# EAGLE design Platine1 (EAGLE 7.2.0)
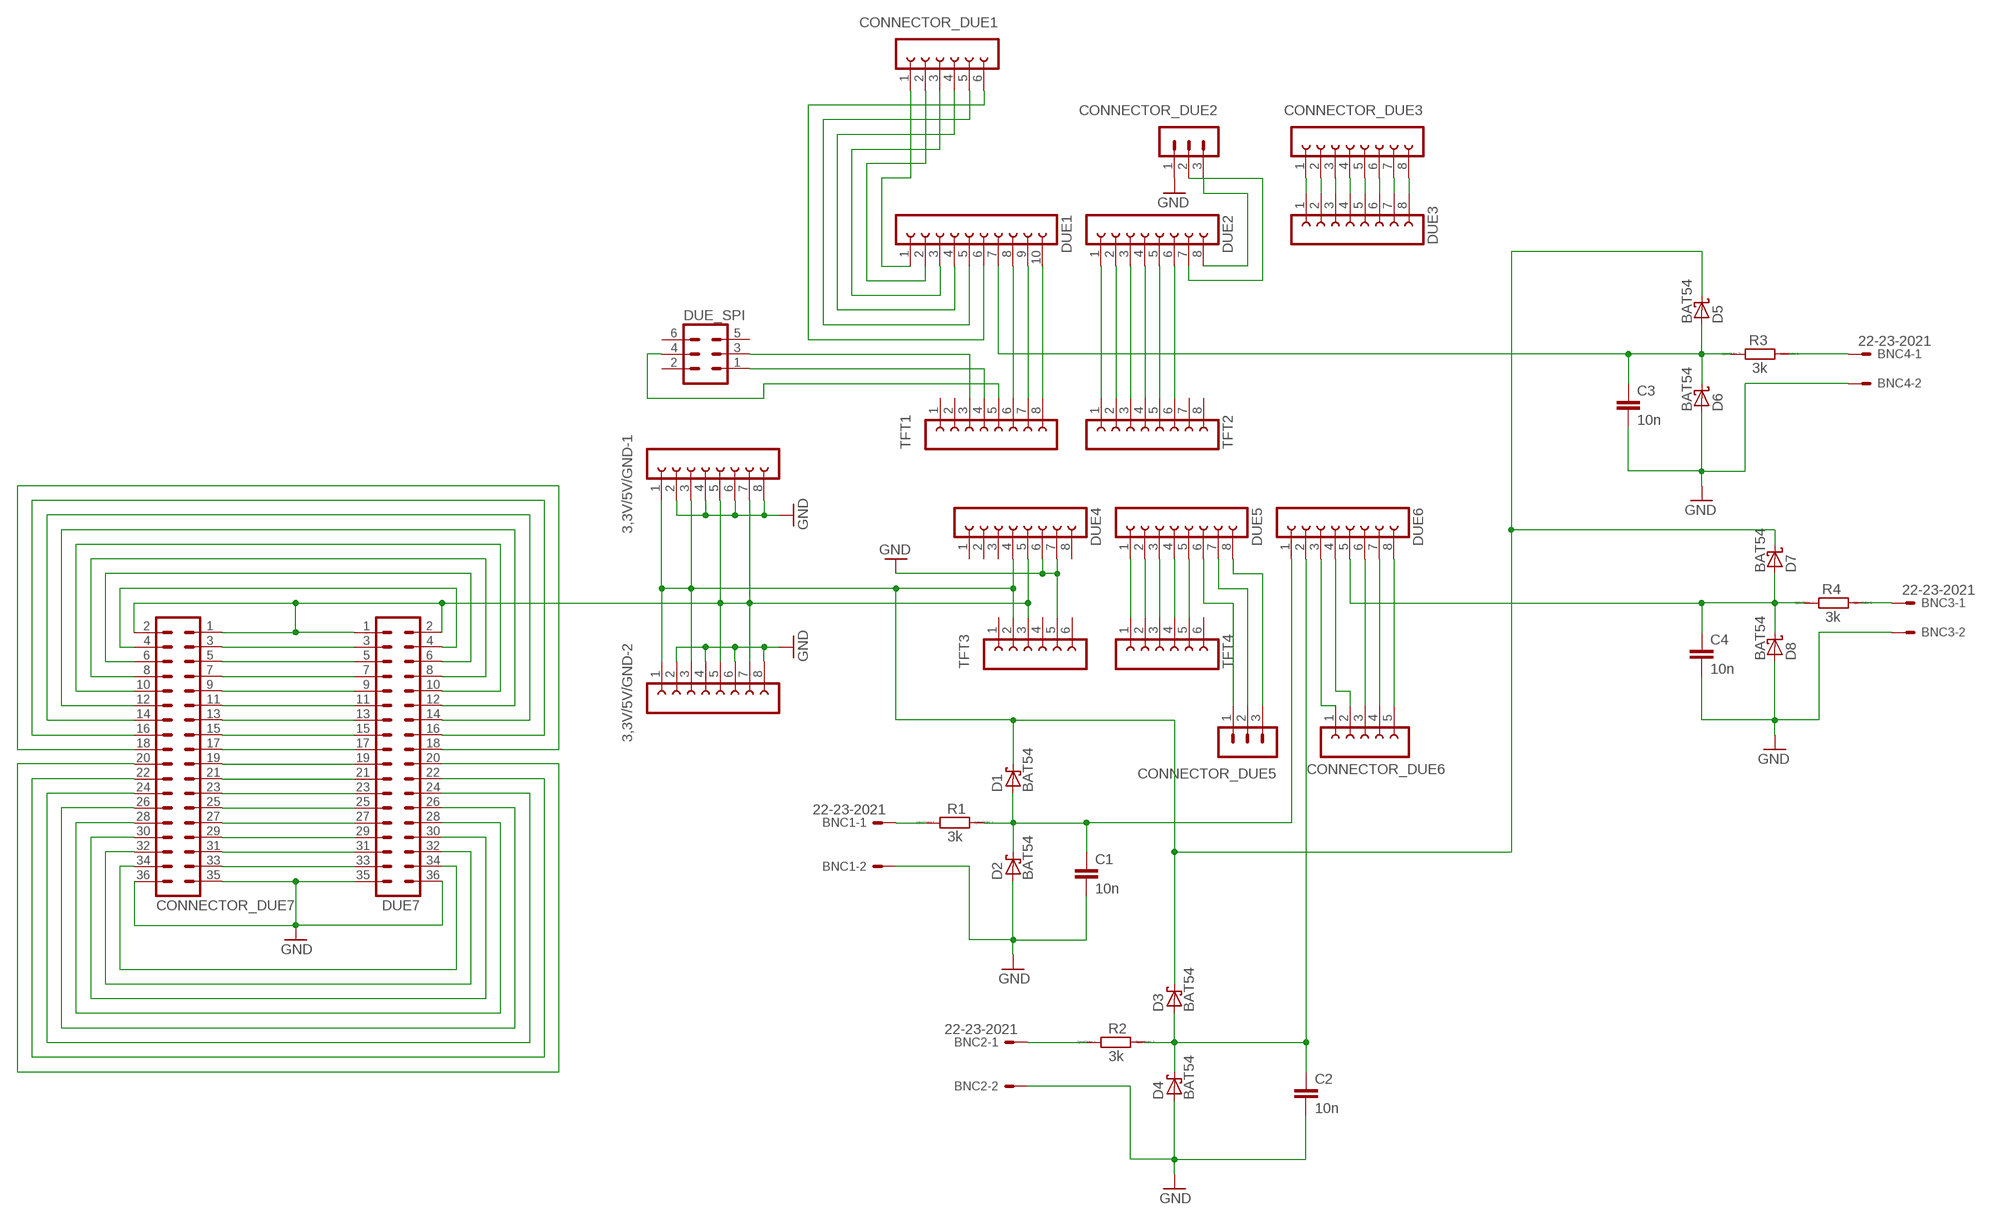
[diagram p0: schematic, sheet 1]

## Parts
3,3V/5V/GND-1  FE08-1  [FE08]
3,3V/5V/GND-2  FE08-1  [FE08]
BNC1  22-23-2021  [22-23-2021]
BNC2  22-23-2021  [22-23-2021]
BNC3  22-23-2021  [22-23-2021]
BNC4  22-23-2021  [22-23-2021]
C1  10n  C-EU025-024X044  [C025-024X044]
C2  10n  C-EU025-024X044  [C025-024X044]
C3  10n  C-EU025-024X044  [C025-024X044]
C4  10n  C-EU025-024X044  [C025-024X044]
CONNECTOR_DUE1  FE06-1  [FE06]
CONNECTOR_DUE2  MA03-1  [MA03-1]
CONNECTOR_DUE3  FE08-1  [FE08]
CONNECTOR_DUE5  MA03-1  [MA03-1]
CONNECTOR_DUE6  FE05-1  [FE05-1]
CONNECTOR_DUE7  MA18-2  [MA18-2]
D1  BAT54  [SOT23]
D2  BAT54  [SOT23]
D3  BAT54  [SOT23]
D4  BAT54  [SOT23]
D5  BAT54  [SOT23]
D6  BAT54  [SOT23]
D7  BAT54  [SOT23]
D8  BAT54  [SOT23]
DUE1  FE10-1  [FE10]
DUE2  FE08-1  [FE08]
DUE3  FE08-1  [FE08]
DUE4  FE08-1  [FE08]
DUE5  FE08-1  [FE08]
DUE6  FE08-1  [FE08]
DUE7  MA18-2  [MA18-2]
DUE_SPI  MA03-2  [MA03-2]
R1  3k  R-EU_0207_12  [0207/12]
R2  3k  R-EU_0207_12  [0207/12]
R3  3k  R-EU_0207_12  [0207/12]
R4  3k  R-EU_0207_12  [0207/12]
TFT1  FE08-1  [FE08]
TFT2  FE08-1  [FE08]
TFT3  FE06-1  [FE06]
TFT4  FE06-1  [FE06]

## Nets
GND: 3,3V/5V/GND-1.2 3,3V/5V/GND-1.4 3,3V/5V/GND-1.6 3,3V/5V/GND-1.8 3,3V/5V/GND-2.2 3,3V/5V/GND-2.4 3,3V/5V/GND-2.6 3,3V/5V/GND-2.8 BNC1.2 BNC2.2 BNC3.2 BNC4.2 C1.2 C2.2 C3.2 C4.2 CONNECTOR_DUE2.1 CONNECTOR_DUE7.35 CONNECTOR_DUE7.36 D2.1(A) D4.1(A) D6.1(A) D8.1(A) DUE4.6 DUE4.7 DUE7.35 DUE7.36 TFT3.5
N$1: C1.1 D1.1(A) D2.3(C) DUE6.1 R1.2
N$2: C2.1 D3.1(A) D4.3(C) DUE6.2 R2.2
N$3: BNC1.1 R1.1
N$4: BNC2.1 R2.1
N$5: DUE1.10 TFT1.8
N$6: DUE1.9 TFT1.7
N$7: DUE1.8 TFT1.6
N$8: DUE_SPI.3 TFT1.3
N$9: DUE_SPI.1 TFT1.4
N$10: DUE_SPI.4 TFT1.5
N$11: C3.1 D5.1(A) D6.3(C) DUE1.7 R3.2
N$12: CONNECTOR_DUE3.1 DUE3.1
N$13: DUE2.1 TFT2.1
N$14: DUE2.2 TFT2.2
N$15: DUE2.3 TFT2.3
N$16: DUE2.4 TFT2.4
N$17: DUE2.5 TFT2.5
N$18: DUE2.6 TFT2.6
N$19: CONNECTOR_DUE7.3 DUE7.3
N$20: CONNECTOR_DUE7.5 DUE7.5
N$21: CONNECTOR_DUE7.7 DUE7.7
N$22: BNC4.1 R3.1
N$23: C4.1 D7.1(A) D8.3(C) DUE6.5 R4.2
N$24: D3.3(C)
N$26: CONNECTOR_DUE7.9 DUE7.9
N$27: BNC3.1 R4.1
N$28: DUE5.1 TFT4.1
N$29: DUE5.2 TFT4.2
N$30: DUE5.3 TFT4.3
N$31: DUE5.4 TFT4.4
N$32: DUE5.5 TFT4.5
N$33: CONNECTOR_DUE7.11 DUE7.11
N$34: CONNECTOR_DUE7.13 DUE7.13
N$35: CONNECTOR_DUE7.15 DUE7.15
N$36: CONNECTOR_DUE7.17 DUE7.17
N$37: CONNECTOR_DUE7.19 DUE7.19
N$38: CONNECTOR_DUE7.21 DUE7.21
N$39: CONNECTOR_DUE7.23 DUE7.23
N$40: CONNECTOR_DUE7.25 DUE7.25
N$41: CONNECTOR_DUE7.27 DUE7.27
N$42: CONNECTOR_DUE7.29 DUE7.29
N$43: CONNECTOR_DUE7.31 DUE7.31
N$44: CONNECTOR_DUE7.33 DUE7.33
N$45: CONNECTOR_DUE7.34 DUE7.34
N$46: CONNECTOR_DUE7.32 DUE7.32
N$47: CONNECTOR_DUE7.4 DUE7.4
N$48: CONNECTOR_DUE7.6 DUE7.6
N$49: CONNECTOR_DUE7.8 DUE7.8
N$50: CONNECTOR_DUE7.10 DUE7.10
N$51: CONNECTOR_DUE7.12 DUE7.12
N$52: CONNECTOR_DUE7.14 DUE7.14
N$53: CONNECTOR_DUE7.16 DUE7.16
N$54: CONNECTOR_DUE7.18 DUE7.18
N$55: CONNECTOR_DUE7.30 DUE7.30
N$56: CONNECTOR_DUE7.28 DUE7.28
N$57: CONNECTOR_DUE7.26 DUE7.26
N$58: CONNECTOR_DUE7.24 DUE7.24
N$59: CONNECTOR_DUE7.22 DUE7.22
N$60: CONNECTOR_DUE7.20 DUE7.20
N$61: CONNECTOR_DUE3.2 DUE3.2
N$62: CONNECTOR_DUE3.3 DUE3.3
N$63: CONNECTOR_DUE3.4 DUE3.4
N$64: CONNECTOR_DUE3.5 DUE3.5
N$65: CONNECTOR_DUE3.6 DUE3.6
N$66: CONNECTOR_DUE3.7 DUE3.7
N$67: CONNECTOR_DUE3.8 DUE3.8
N$68: CONNECTOR_DUE1.1 DUE1.1
N$69: CONNECTOR_DUE1.2 DUE1.2
N$70: CONNECTOR_DUE1.3 DUE1.3
N$71: CONNECTOR_DUE1.4 DUE1.4
N$72: CONNECTOR_DUE1.5 DUE1.5
N$73: CONNECTOR_DUE1.6 DUE1.6
N$74: CONNECTOR_DUE2.3 DUE2.8
N$75: CONNECTOR_DUE2.2 DUE2.7
N$76: CONNECTOR_DUE5.1 DUE5.6
N$77: CONNECTOR_DUE5.2 DUE5.7
N$78: CONNECTOR_DUE5.3 DUE5.8
N$79: CONNECTOR_DUE6.1 DUE6.3
N$80: CONNECTOR_DUE6.2 DUE6.4
N$81: CONNECTOR_DUE6.3 DUE6.6
N$82: CONNECTOR_DUE6.4 DUE6.7
N$83: CONNECTOR_DUE6.5 DUE6.8
N$84: 3,3V/5V/GND-1.1 3,3V/5V/GND-1.3 3,3V/5V/GND-2.1 3,3V/5V/GND-2.3 D1.3(C) D5.3(C) D7.3(C) DUE4.4 TFT3.2
N$85: 3,3V/5V/GND-1.5 3,3V/5V/GND-1.7 3,3V/5V/GND-2.5 3,3V/5V/GND-2.7 CONNECTOR_DUE7.1 CONNECTOR_DUE7.2 DUE4.5 DUE7.1 DUE7.2 TFT3.3
Unconnected: DUE4.1 DUE4.2 DUE4.3 DUE4.8 DUE_SPI.2 DUE_SPI.5 DUE_SPI.6 TFT1.1 TFT1.2 TFT2.7 TFT2.8 TFT3.1 TFT3.4 TFT3.6 TFT4.6

## Library data of the parts
3,3V/5V/GND-1 3,3V/5V/GND-2 CONNECTOR_DUE3 DUE2-DUE6 TFT1 TFT2 = con-lsta:FE08-1: FEMALE HEADER; OC_FARNELL: unknown; OC_NEWARK: unknown
BNC1-BNC4 = con-molex:22-23-2021: .100" (2.54mm) Center Header - 2 Pin; MF: MOLEX; MPN: 22-23-2021; OC_FARNELL: 1462926; OC_NEWARK: 25C3832
C1-C4 = resistor:C-EU: CAPACITOR, European symbol
CONNECTOR_DUE1 TFT3 TFT4 = con-lsta:FE06-1: FEMALE HEADER; OC_FARNELL: unknown; OC_NEWARK: unknown
CONNECTOR_DUE2 CONNECTOR_DUE5 = con-lstb:MA03-1: PIN HEADER; OC_FARNELL: unknown; OC_NEWARK: unknown
CONNECTOR_DUE6 = con-lsta:FE05-1: FEMALE HEADER; OC_FARNELL: unknown; OC_NEWARK: unknown
CONNECTOR_DUE7 DUE7 = con-lstb:MA18-2: PIN HEADER; OC_FARNELL: unknown; OC_NEWARK: unknown
D1-D8 = diode:BAT54: Schottky Diodes Source: Fairchild .. BAT54.pdf
DUE1 = con-lsta:FE10-1: FEMALE HEADER; OC_FARNELL: unknown; OC_NEWARK: unknown
DUE_SPI = con-lstb:MA03-2: PIN HEADER; OC_FARNELL: unknown; OC_NEWARK: unknown
R1-R4 = resistor:R-EU_: RESISTOR, European symbol; SPICEPREFIX: R

## Board
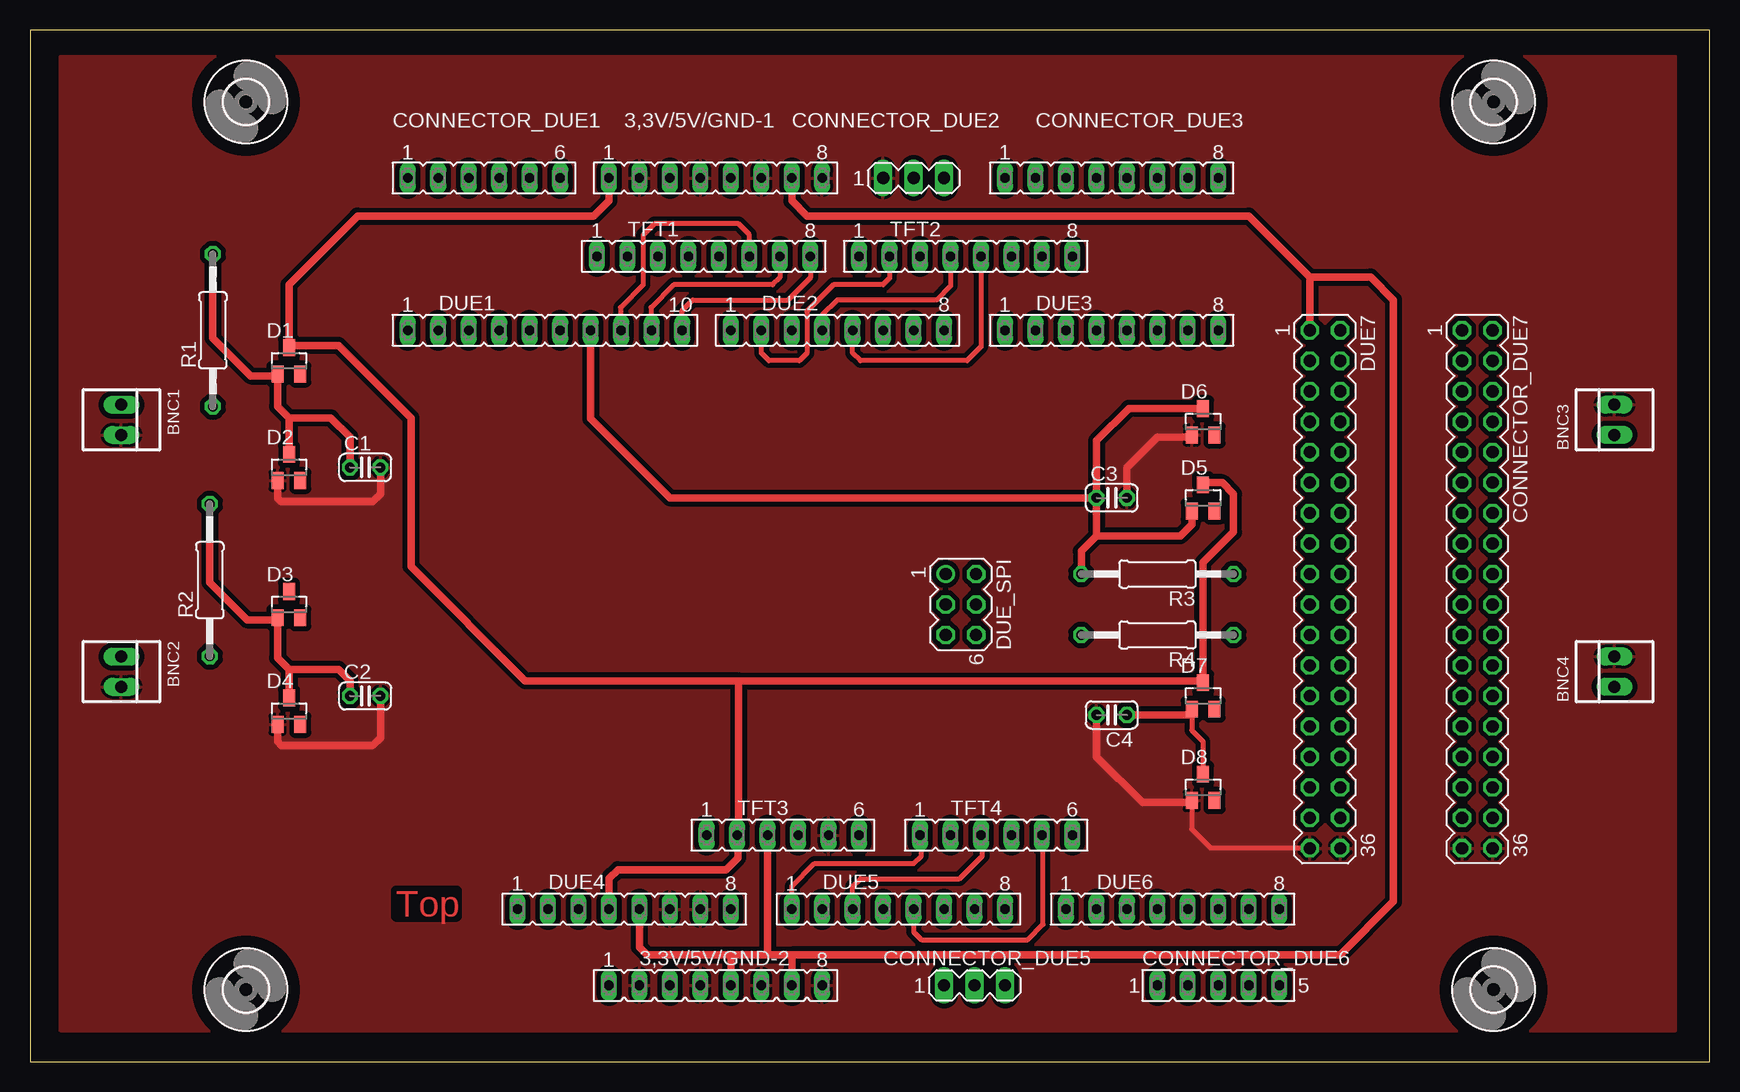
[diagram p1: board, top side]
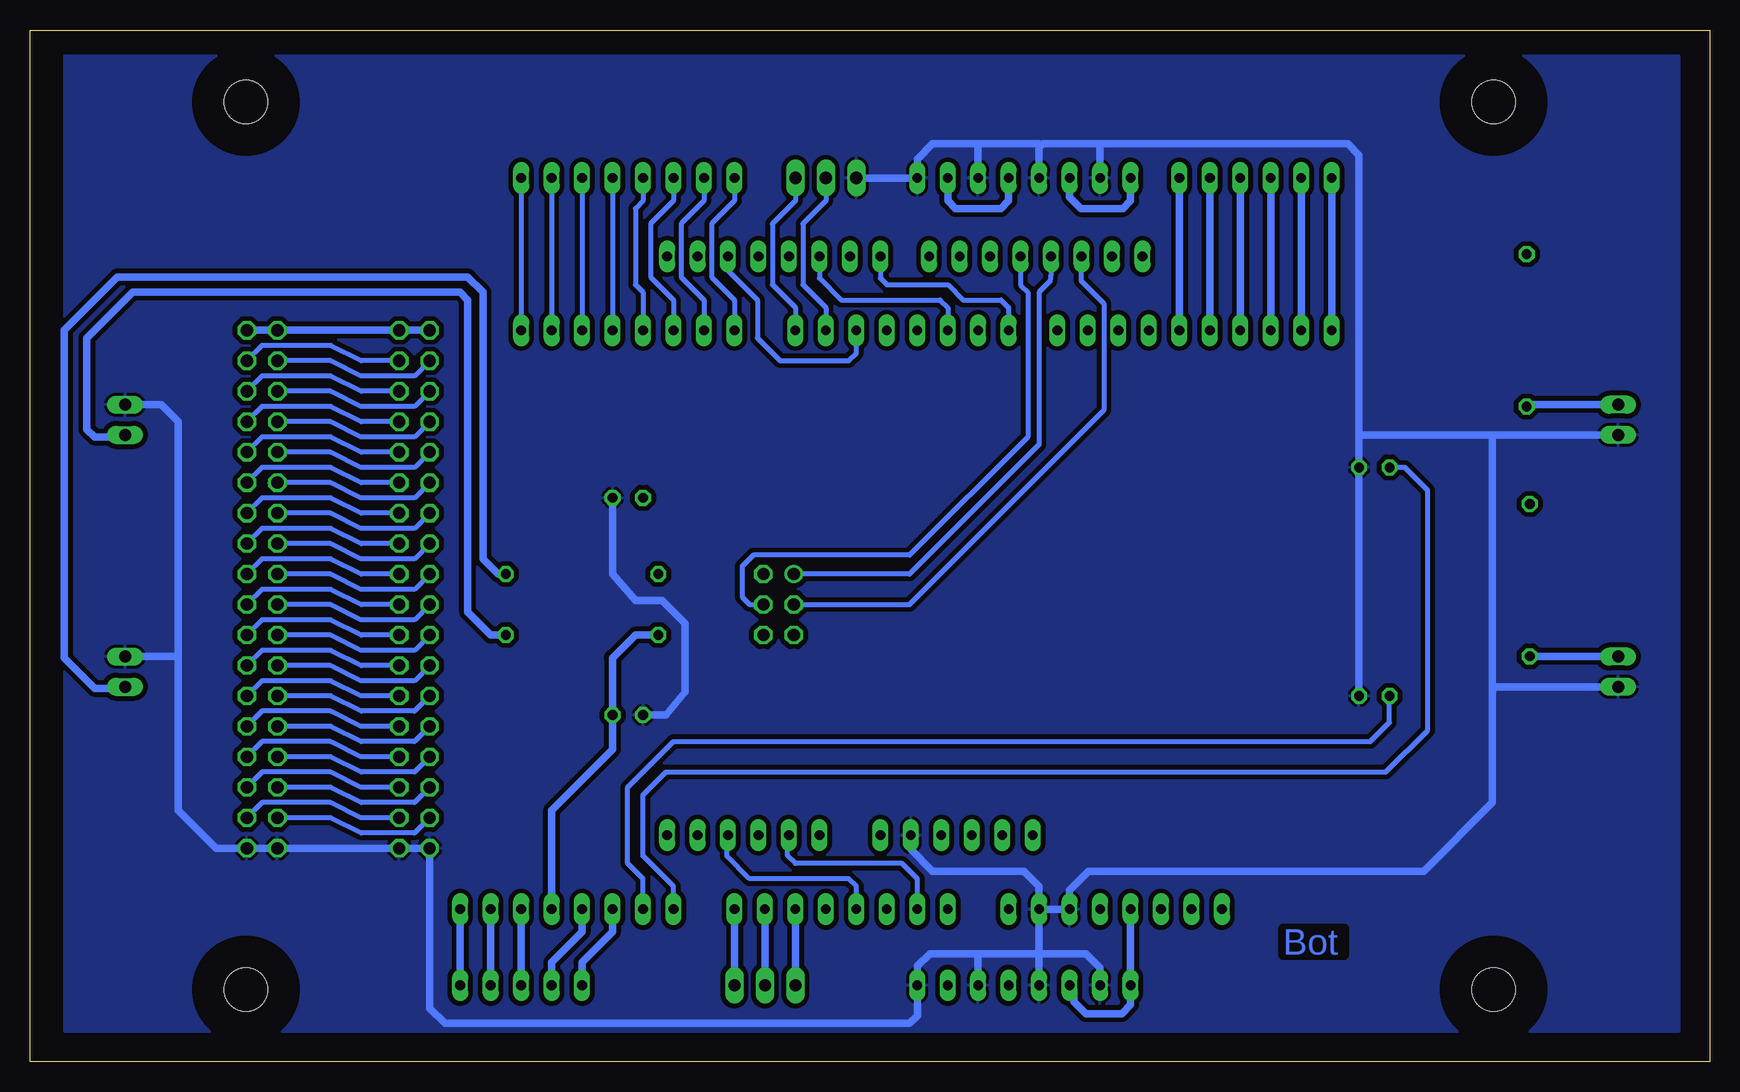
[diagram p2: board, bottom side, seen from below]

Size 140 x 86 mm. Coordinates in mm from the lower left corner, seen from the top.
Outline: 0,0 140,0 140,86 0,86 0,0
Copper layers (1*16): Top 0.035mm / dielectric 1.5mm / Bottom 0.035mm
Design rules "default": minimum track width 10mil, minimum drill 24mil, track to track 8mil, track to pad 8mil, pad to pad 8mil, via to via 8mil, smd to smd 8mil, copper to edge 40mil, drill to drill 8mil, minimum pad ring 10mil, minimum via ring 8mil, stop-mask expansion 4mil, vias tented up to drill 0mil, thermal gap 10mil

### Footprints (pad centres in the part's own frame; a part is rotated, then mirrored left to right if it is on the bottom)
FE08 = drill 0.813 long: 1 -8.89,0; 2 -6.35,0; 3 -3.81,0; 4 -1.27,0; 5 1.27,0; 6 3.81,0; 7 6.35,0; 8 8.89,0
22-23-2021 = drill 1 long: 1 -1.27,0; 2 1.27,0
C025-024X044 = drill 0.813 octagon: 1 -1.27,0; 2 1.27,0
FE06 = drill 0.813 long: 1 -6.35,0; 2 -3.81,0; 3 -1.27,0; 4 1.27,0; 5 3.81,0; 6 6.35,0
MA03-1 = drill 1.016 long: 1 -2.54,0; 2 0,0; 3 2.54,0
FE05-1 = drill 0.813 long: 1 -5.08,0; 2 -2.54,0; 3 0,0; 4 2.54,0; 5 5.08,0
MA18-2 = drill 1.016 octagon: 1 -21.59,-1.27; 2 -21.59,1.27; 3 -19.05,-1.27; 4 -19.05,1.27; 5 -16.51,-1.27; 6 -16.51,1.27; 7 -13.97,-1.27; 8 -13.97,1.27; 9 -11.43,-1.27; 10 -11.43,1.27; 11 -8.89,-1.27; 12 -8.89,1.27; 13 -6.35,-1.27; 14 -6.35,1.27; 15 -3.81,-1.27; 16 -3.81,1.27; 17 -1.27,-1.27; 18 -1.27,1.27; 19 1.27,-1.27; 20 1.27,1.27; 21 3.81,-1.27; 22 3.81,1.27; 23 6.35,-1.27; 24 6.35,1.27; 25 8.89,-1.27; 26 8.89,1.27; 27 11.43,-1.27; 28 11.43,1.27; 29 13.97,-1.27; 30 13.97,1.27; 31 16.51,-1.27; 32 16.51,1.27; 33 19.05,-1.27; 34 19.05,1.27; 35 21.59,-1.27; 36 21.59,1.27
SOT23 = smd 1 x 1.4: 1 -0.95,-1.1; 2 0.95,-1.1; 3 0,1.1
FE10 = drill 0.813 long: 1 -11.43,0; 2 -8.89,0; 3 -6.35,0; 4 -3.81,0; 5 -1.27,0; 6 1.27,0; 7 3.81,0; 8 6.35,0; 9 8.89,0; 10 11.43,0
MA03-2 = drill 1.016: 1 -2.54,-1.27 | drill 1.016 octagon: 2 -2.54,1.27; 3 0,-1.27; 4 0,1.27; 5 2.54,-1.27; 6 2.54,1.27
0207/12 = drill 0.813 octagon: 1 -6.35,0; 2 6.35,0
3,6 = hole 3.6: 0,0

### Placement (x,y rotation side)
3,3V/5V/GND-1  57.15,73.66 0 top
3,3V/5V/GND-2  57.15,6.35 0 top
BNC1  7.62,53.5 270 top
BNC2  7.62,32.5 270 top
BNC3  132.08,53.5 90 top
BNC4  132.08,32.5 90 top
C1  27.94,49.53 0 top
C2  27.94,30.48 0 top
C3  90.17,46.99 0 top
C4  90.17,28.89 180 top
CONNECTOR_DUE1  37.85,73.66 0 top
CONNECTOR_DUE2  73.66,73.66 0 top
CONNECTOR_DUE3  90.17,73.66 0 top
CONNECTOR_DUE5  78.74,6.35 0 top
CONNECTOR_DUE6  99.06,6.35 0 top
CONNECTOR_DUE7  120.65,39.37 270 top
D1  21.59,58.42 0 top
D2  21.59,49.53 0 top
D3  21.59,38.1 0 top
D4  21.59,29.21 0 top
D5  97.79,46.99 0 top
D6  97.79,53.34 0 top
D7  97.79,30.48 0 top
D8  97.79,22.86 0 top
DUE1  42.93,60.96 0 top
DUE2  67.31,60.96 0 top
DUE3  90.17,60.96 0 top
DUE4  49.53,12.7 0 top
DUE5  72.39,12.7 0 top
DUE6  95.25,12.7 0 top
DUE7  107.95,39.37 270 top
DUE_SPI  77.6,38.1 270 top
R1  15.24,60.96 90 top
R2  14.99,40.13 90 top
R3  93.98,40.64 180 top
R4  93.98,35.56 180 top
TFT1  56.16,67.13 0 top
TFT2  78,67.13 0 top
TFT3  62.76,18.87 0 top
TFT4  80.54,18.87 0 top
U$5  [3,6]  18,80 0 top
U$6  [3,6]  122,80 0 top
U$7  [3,6]  122,6 0 top
U$8  [3,6]  18,6 0 top

### Tracks (layer width: path | path; a pad name or v marks a point on that pad's centre or on a via)
GND
  Top 0.406: DUE7.35 98.42,17.78 96.84,19.36 96.84,21.27 D8.1
  Top 0.61: D2.1 20.64,46.99 20.95,46.67 28.57,46.67 29.21,47.31 C1.2 | D4.1 20.64,26.67 20.95,26.35 28.57,26.35 29.21,26.99 C2.2 | C3.2 91.44,49.53 93.98,52.07 96.67,52.07 D6.1 | C4.2 88.9,25.4 92.71,21.59 96.52,21.59 96.84,21.27
  Bottom 0.61: DUE4.7 DUE4.6 53.34,14.29 51.75,15.88 23.81,15.88 18.1,21.59 18.1,30.8 | DUE4.7 55.88,9 | 55.88,9 3,3V/5V/GND-2.4 55.88,8.88 56,9 61,9 | 3,3V/5V/GND-2.2 50.8,7.8 52,9 55.88,9 | 61,9 61,6.39 3,3V/5V/GND-2.6 | 61,9 65,9 66.04,7.96 3,3V/5V/GND-2.8 66.04,3.81 66.67,3.17 105.41,3.17 106.68,4.45 DUE7.35 DUE7.36 CONNECTOR_DUE7.35 CONNECTOR_DUE7.36 124.46,17.78 127.64,20.95 127.64,33.66 | TFT3.5 66.57,17.68 64.77,15.88 57.15,15.88 55.88,14.61 DUE4.7 | CONNECTOR_DUE2.1 3,3V/5V/GND-1.8 66.04,75.25 64.77,76.52 60.96,76.52 | 60.96,76.52 3,3V/5V/GND-1.6 | 3,3V/5V/GND-1.4 55.88,76.2 | 55.88,76.2 55.88,76.52 60.96,76.52 | 50.8,74.61 51.12,73.66 3,3V/5V/GND-1.2 50.8,76.52 | 50.8,76.52 55.56,76.52 55.88,76.2 | 50.8,76.52 30.16,76.52 29.21,75.56 29.21,52.39 | 29.21,52.39 C1.2 C2.2 | BNC1.2 18.1,52.23 | 18.1,52.23 29.05,52.23 29.21,52.39 | 18.1,30.8 18.1,52.23 | BNC2.2 17.98,31.23 18.1,30.8 | C3.2 91.44,40.64 89.53,38.42 87.31,38.42 85.41,36.51 85.41,30.8 87,28.89 C4.2 | BNC3.2 129.06,54.77 127.64,53.34 127.64,33.66 | BNC4.2 127.75,33.77 127.64,33.66
  pour Bottom (isolate 0.406): 2.54,83.82 137.16,83.82 137.16,2.54 2.54,2.54
  pour Top (isolate 0.406): 2.54,83.82 137.16,83.82 137.16,2.54 2.54,2.54
N$1
  Top 0.61: R1.2 15.24,60.33 18.41,57.15 20.47,57.15 D1.1 20.64,54.61 21.59,53.66 | 21.59,53.66 D2.3 | C1.1 26.67,52.07 25.08,53.66 21.59,53.66
  Bottom 0.406: DUE6.1 86.36,14.61 88.9,17.14 88.9,22.23 87,24.13 26.99,24.13 23.5,27.62 23.5,47.62 25.4,49.53 C1.1
N$2
  Top 0.61: D3.1 20.64,36.51 | 20.64,36.51 20.64,33.65 21.59,32.7 | 21.59,32.7 D4.3 | C2.1 26.67,31.75 25.72,32.7 21.59,32.7 | R2.2 14.99,39.94 18.1,36.83 20.32,36.83 20.64,36.51
  Bottom 0.406: DUE6.2 88.9,15.24 90.17,16.51 90.17,22.86 86.36,26.67 28.26,26.67 26.67,28.26 C2.1
N$3
  Bottom 0.61: BNC1.1 15.08,54.77 R1.1
N$4
  Bottom 0.61: BNC2.1 14.97,33.77 R2.1
N$5
  Top 0.406: DUE1.10 54.36,62.61 55.24,63.5 63.18,63.5 65.09,65.41 65.09,67.09 TFT1.8
N$6
  Top 0.406: TFT1.7 62.51,65.37 61.91,64.77 53.66,64.77 51.75,62.87 51.75,61.02 DUE1.9
N$7
  Top 0.406: TFT1.6 59.97,68.94 59.05,69.85 52.07,69.85 51.12,68.9 51.12,64.77 49.21,62.87 49.21,61.02 DUE1.8
N$8
  Bottom 0.406: DUE_SPI.3 66.67,38.1 50.48,54.29 50.48,63.18 52.39,65.09 52.39,66.99 52.35,66.64 TFT1.3
N$9
  Bottom 0.406: TFT1.4 54.89,65.68 54.97,65.05 55.88,64.14 55.88,51.44 66.67,40.64 DUE_SPI.1
N$10
  Bottom 0.406: TFT1.5 57.43,64.73 56.83,64.14 56.83,52.07 66.67,42.23 79.69,42.23 80.64,41.27 80.64,38.73 80.01,38.1 DUE_SPI.4
N$11
  Top 0.61: DUE1.7 46.74,53.59 53.34,46.99 C3.1 | C3.1 88.9,43.81 | 88.9,43.81 87.63,42.55 R3.2 | D5.1 96.84,44.77 95.89,43.81 88.9,43.81 | D6.3 91.59,54.44 88.9,51.75 C3.1
N$12
  Bottom 0.406: CONNECTOR_DUE3.1 81.28,71.75 83.19,69.85 83.19,65.41 81.28,63.5 DUE3.1
N$13
  Bottom 0.406: TFT2.1 69.11,65.3 68.58,64.77 63.5,64.77 62.23,63.5 59.05,63.5 58.42,62.87 DUE2.1
N$14
  Top 0.406: TFT2.2 71.65,65.3 71.12,64.77 66.99,64.77 64.77,62.55 64.77,59.05 64.14,58.42 61.59,58.42 60.96,59.05 DUE2.2
N$15
  Bottom 0.406: TFT2.3 74.19,65.3 72.39,63.5 64.14,63.5 63.5,62.87 DUE2.3
N$16
  Top 0.406: TFT2.4 76.73,64.67 75.56,63.5 67.31,63.5 66.04,62.23 DUE2.4
N$17
  Top 0.406: TFT2.5 79.27,59.59 78.11,58.42 69.22,58.42 68.58,59.05 DUE2.5
N$18
  Bottom 0.406: TFT2.6 81.81,65.94 79.38,63.5 79.38,60.33 77.47,58.42 71.75,58.42 71.12,59.05 DUE2.6
N$19
  Bottom 0.406: DUE7.3 107.95,57.15 112.39,57.15 114.94,58.42 CONNECTOR_DUE7.3
N$20
  Bottom 0.406: DUE7.5 107.95,54.61 112.39,54.61 114.94,55.88 CONNECTOR_DUE7.5
N$21
  Bottom 0.406: DUE7.7 107.95,52.07 112.39,52.07 114.94,53.34 CONNECTOR_DUE7.7
N$22
  Bottom 0.61: R3.1 100.97,40.64 102.23,41.91 102.23,64.14 103.5,65.41 132.72,65.41 137.16,60.96 137.16,33.66 134.62,31.11 132.19,31.11 BNC4.1
N$23
  Top 0.406: D7.1 96.84,27.62 97.79,26.67 D8.3
  Top 0.61: D7.1 96.84,28.89 C4.1
  Bottom 0.61: R4.2 89.53,35.56 91.44,33.66 C4.1 91.44,26.04 96.52,20.95 DUE6.5
N$26
  Bottom 0.406: DUE7.9 107.95,49.53 112.39,49.53 114.94,50.8 CONNECTOR_DUE7.9
N$27
  Bottom 0.61: R4.1 101.6,35.56 103.5,37.47 103.5,63.5 104.14,64.14 131.44,64.14 135.25,60.33 135.25,52.7 134.62,52.07 132.24,52.07 BNC3.1
N$28
  Top 0.406: DUE5.1 63.5,14.61 65.41,16.51 73.66,16.51 74.3,17.14 74.3,18.77 TFT4.1
N$29
  Bottom 0.406: DUE5.2 66.04,15.24 67.31,16.51 76.2,16.51 76.83,17.14 76.83,18.77 TFT4.2
N$30
  Top 0.406: DUE5.3 68.58,14.61 69.22,15.24 77.47,15.24 79.38,17.14 79.38,18.77 TFT4.3
N$31
  Bottom 0.406: DUE5.4 71.12,14.61 71.75,15.24 80.01,15.24 81.92,17.14 81.92,18.77 TFT4.4
N$32
  Top 0.406: DUE5.5 73.66,10.79 74.3,10.16 83.19,10.16 84.45,11.43 84.45,18.77 TFT4.5
N$33
  Bottom 0.406: DUE7.11 107.95,46.99 112.39,46.99 114.94,48.26 CONNECTOR_DUE7.11 120.02,48.26
N$34
  Bottom 0.406: DUE7.13 107.95,44.45 112.39,44.45 114.94,45.72 CONNECTOR_DUE7.13
N$35
  Bottom 0.406: DUE7.15 107.95,41.91 112.39,41.91 114.94,43.18 CONNECTOR_DUE7.15
N$36
  Bottom 0.406: DUE7.17 107.95,39.37 112.39,39.37 114.94,40.64 CONNECTOR_DUE7.17
N$37
  Bottom 0.406: DUE7.19 107.95,36.83 112.39,36.83 114.94,38.1 CONNECTOR_DUE7.19
N$38
  Bottom 0.406: DUE7.21 107.95,34.29 112.39,34.29 114.94,35.56 CONNECTOR_DUE7.21
N$39
  Bottom 0.406: DUE7.23 107.95,31.75 112.39,31.75 114.94,33.02 CONNECTOR_DUE7.23
N$40
  Bottom 0.406: DUE7.25 107.95,29.21 112.39,29.21 114.94,30.48 CONNECTOR_DUE7.25
N$41
  Bottom 0.406: DUE7.27 107.95,26.67 112.39,26.67 114.94,27.94 CONNECTOR_DUE7.27
N$42
  Bottom 0.406: DUE7.29 107.95,24.13 112.39,24.13 114.94,25.4 CONNECTOR_DUE7.29
N$43
  Bottom 0.406: DUE7.31 107.95,21.59 112.39,21.59 114.94,22.86 CONNECTOR_DUE7.31
N$44
  Bottom 0.406: DUE7.33 107.95,19.05 112.39,19.05 114.94,20.32 CONNECTOR_DUE7.33
N$45
  Bottom 0.406: DUE7.34 112.39,20.32 114.94,21.59 120.65,21.59 CONNECTOR_DUE7.34
N$46
  Bottom 0.406: DUE7.32 112.39,22.86 114.94,24.13 120.65,24.13 CONNECTOR_DUE7.32
N$47
  Bottom 0.406: DUE7.4 112.39,58.42 114.94,59.69 120.65,59.69 CONNECTOR_DUE7.4
N$48
  Bottom 0.406: DUE7.6 112.39,55.88 114.94,57.15 120.65,57.15 CONNECTOR_DUE7.6
N$49
  Bottom 0.406: DUE7.8 112.39,53.34 114.94,54.61 120.65,54.61 CONNECTOR_DUE7.8
N$50
  Bottom 0.406: DUE7.10 112.39,50.8 114.94,52.07 120.65,52.07 CONNECTOR_DUE7.10
N$51
  Bottom 0.406: DUE7.12 112.39,48.26 114.94,49.53 120.65,49.53 CONNECTOR_DUE7.12
N$52
  Bottom 0.406: DUE7.14 112.39,45.72 114.94,46.99 120.65,46.99 CONNECTOR_DUE7.14
N$53
  Bottom 0.406: DUE7.16 112.39,43.18 114.94,44.45 120.65,44.45 CONNECTOR_DUE7.16
N$54
  Bottom 0.406: DUE7.18 112.39,40.64 114.94,41.91 120.65,41.91 CONNECTOR_DUE7.18
N$55
  Bottom 0.406: DUE7.30 112.39,25.4 114.94,26.67 120.65,26.67 CONNECTOR_DUE7.30
N$56
  Bottom 0.406: DUE7.28 112.39,27.94 114.94,29.21 120.65,29.21 CONNECTOR_DUE7.28
N$57
  Bottom 0.406: DUE7.26 112.39,30.48 114.94,31.75 120.65,31.75 CONNECTOR_DUE7.26
N$58
  Bottom 0.406: DUE7.24 112.39,33.02 114.94,34.29 120.65,34.29 CONNECTOR_DUE7.24
N$59
  Bottom 0.406: DUE7.22 112.39,35.56 114.94,36.83 120.65,36.83 CONNECTOR_DUE7.22
N$60
  Bottom 0.406: DUE7.20 112.39,38.1 114.94,39.37 120.65,39.37 CONNECTOR_DUE7.20
N$61
  Bottom 0.406: CONNECTOR_DUE3.2 83.82,71.75 85.72,69.85 85.72,65.41 83.82,63.5 DUE3.2
N$62
  Bottom 0.406: CONNECTOR_DUE3.3 86.36,71.75 88.27,69.85 88.27,65.41 86.36,63.5 DUE3.3
N$63
  Bottom 0.406: CONNECTOR_DUE3.4 88.9,71.75 89.53,71.12 89.53,64.77 88.9,64.14 DUE3.4
N$64
  Bottom 0.406: CONNECTOR_DUE3.5 DUE3.5
N$65
  Bottom 0.406: CONNECTOR_DUE3.6 DUE3.6
N$66
  Bottom 0.406: CONNECTOR_DUE3.7 DUE3.7
N$67
  Bottom 0.406: CONNECTOR_DUE3.8 DUE3.8
N$68
  Bottom 0.61: CONNECTOR_DUE1.1 DUE1.1
N$69
  Bottom 0.61: CONNECTOR_DUE1.2 DUE1.2
N$70
  Bottom 0.61: CONNECTOR_DUE1.3 DUE1.3
N$71
  Bottom 0.61: CONNECTOR_DUE1.4 DUE1.4
N$72
  Bottom 0.61: CONNECTOR_DUE1.5 DUE1.5
N$73
  Bottom 0.61: CONNECTOR_DUE1.6 DUE1.6
N$74
  Bottom 0.406: CONNECTOR_DUE2.3 76.2,71.75 78.11,69.85 78.11,64.77 76.2,62.87 DUE2.8
N$75
  Bottom 0.406: CONNECTOR_DUE2.2 73.66,71.75 75.56,69.85 75.56,64.77 73.66,62.87 DUE2.7
N$76
  Bottom 0.61: DUE5.6 CONNECTOR_DUE5.1
N$77
  Bottom 0.61: DUE5.7 CONNECTOR_DUE5.2
N$78
  Bottom 0.61: DUE5.8 CONNECTOR_DUE5.3
N$79
  Bottom 0.61: DUE6.3 91.44,10.79 93.98,8.26 CONNECTOR_DUE6.1
N$80
  Bottom 0.61: DUE6.4 93.98,10.79 96.52,8.26 CONNECTOR_DUE6.2
N$81
  Bottom 0.61: DUE6.6 CONNECTOR_DUE6.3
N$82
  Bottom 0.61: DUE6.7 CONNECTOR_DUE6.4
N$83
  Bottom 0.61: DUE6.8 CONNECTOR_DUE6.5
N$84
  Top 0.61: DUE4.4 48.26,15.26 49,16 58,16 59,17 59,18.82 TFT3.2 59.05,18.97 59.05,31.75 | 59.05,31.75 97.62,31.75 D7.3 97.79,41.59 100.33,44.13 100.33,47.31 99.38,48.26 97.96,48.26 D5.3 | 3,3V/5V/GND-1.1 48.26,71.75 46.99,70.48 27.3,70.48 21.59,64.77 D1.3 21.76,59.69 25.72,59.69 31.75,53.66 31.75,41.27 41.27,31.75 59.05,31.75
  Bottom 0.61: DUE4.4 3,3V/5V/GND-2.1 48.26,4.74 49,4 52,4 53,5 53,6.01 3,3V/5V/GND-2.3 | 3,3V/5V/GND-1.3 53.34,72.07 52.39,71.12 48.9,71.12 48.26,71.75 3,3V/5V/GND-1.1
N$85
  Top 0.61: DUE4.5 50.8,9.53 51.44,8.89 58.42,8.89 | 3,3V/5V/GND-1.7 63.5,71.75 64.77,70.48 101.6,70.48 106.68,65.41 | 106.68,65.41 DUE7.1 | 106.68,65.41 111.76,65.41 113.67,63.5 113.67,13.34 109.22,8.89 63.5,8.89 | 63.5,8.89 3,3V/5V/GND-2.7 | TFT3.3 61.49,8.99 | 61.49,8.99 61.59,8.89 63.5,8.89 | 3,3V/5V/GND-2.5 58.42,8.89 | 58.42,8.89 61.39,8.89 61.49,8.99
  Bottom 0.61: DUE7.1 DUE7.2 CONNECTOR_DUE7.1 CONNECTOR_DUE7.2 | 3,3V/5V/GND-1.5 58.42,71.75 59.05,71.12 62.87,71.12 63.5,71.75 3,3V/5V/GND-1.7

### Text on the board
Top: Top
Bottom: Bot